# EAGLE design BEP32 (EAGLE 6.5.0)
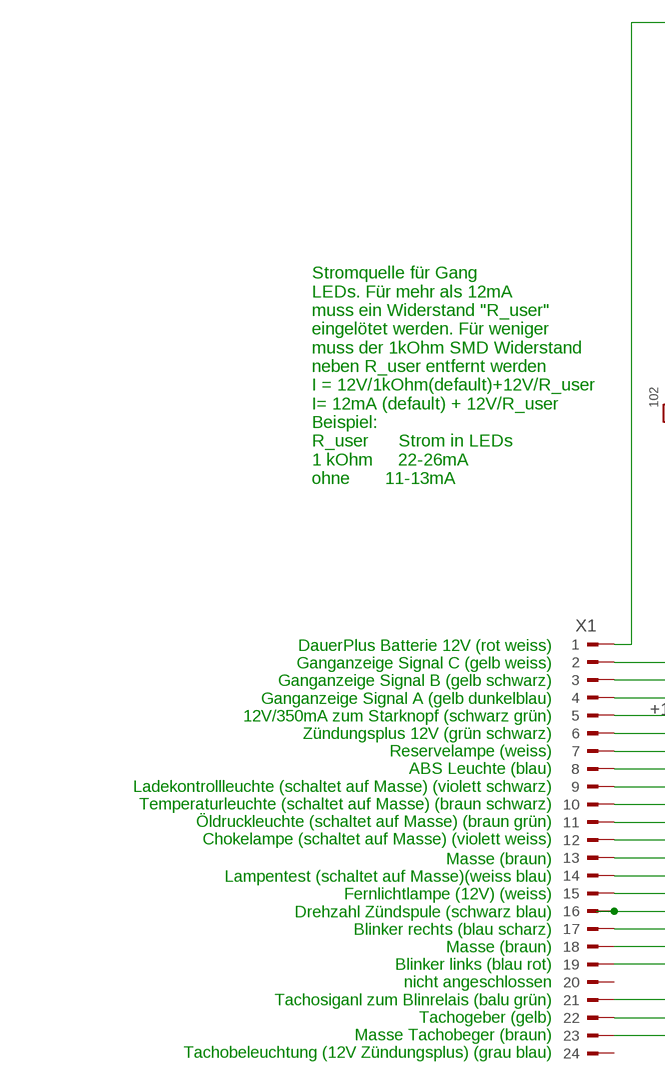
[diagram p0: schematic, sheet 1, part 1 of 2]
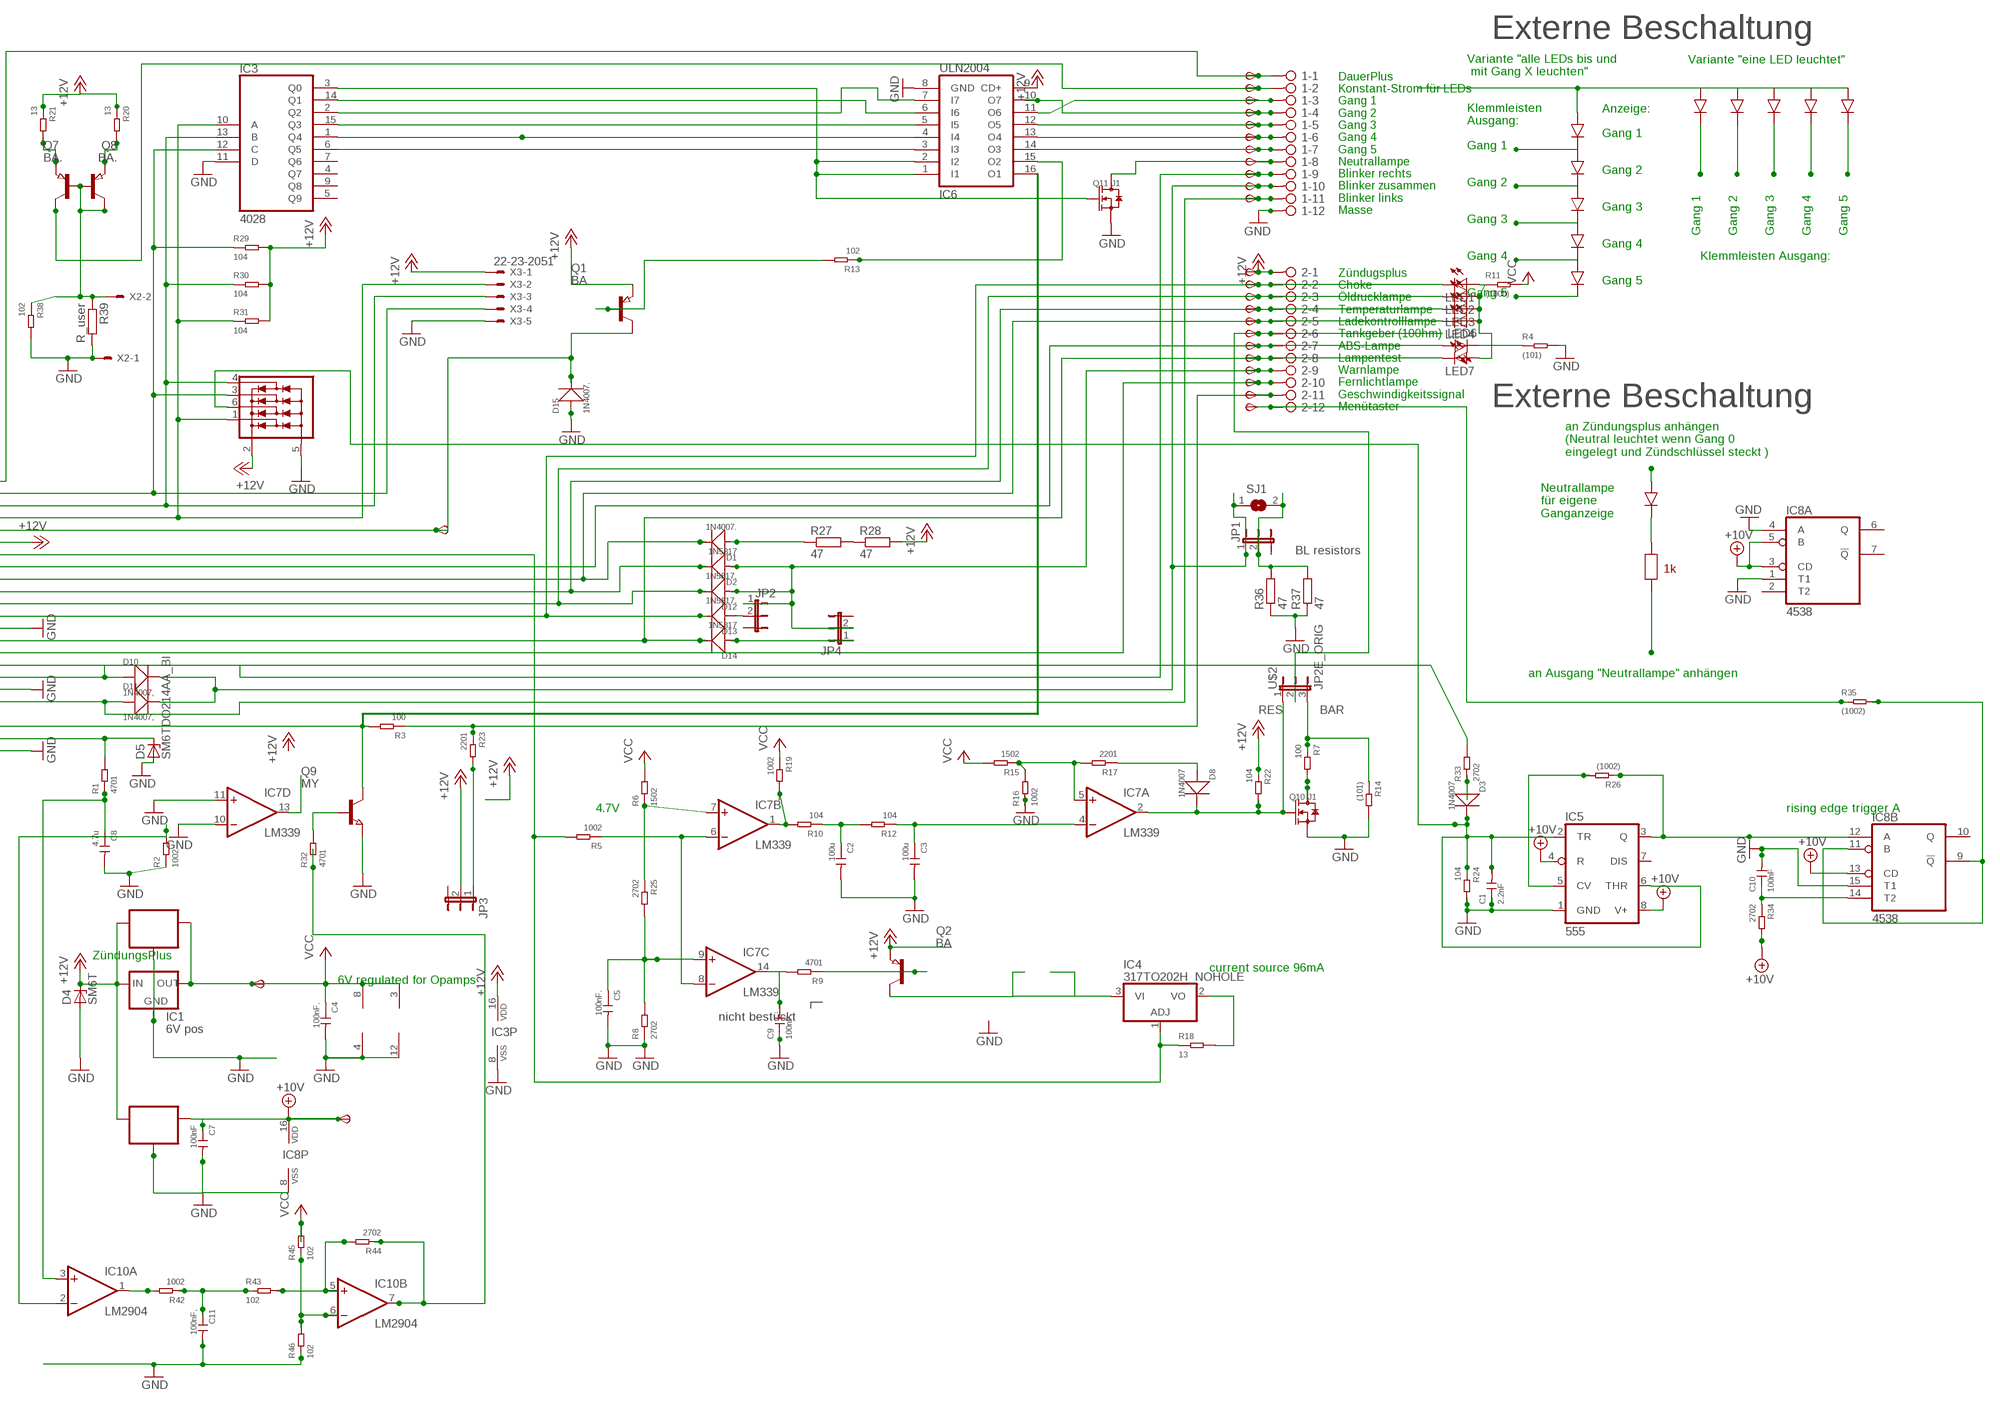
[diagram p1: schematic, sheet 1, part 2 of 2]

## Parts
1  2081-1132  [12-PIN]
2  2081-1132  [12-PIN]
6V  TPSB2.0  [B2.0]
10V  TPSB2.0  [B2.0]
C1  2.2nF  CERAMIC-100NF-50V-10%-X7R(0805)  [C0805]
C2  100u  CERAMIC-100UF-6.3V-20%-X5R(1206)  [C1206]
C3  100u  CERAMIC-100UF-6.3V-20%-X5R(1206)  [C1206]
C4  100nF,  CERAMIC-100NF-50V-10%-X7R(0805)  [C0805]
C5  100nF.  CERAMIC-100NF-50V-10%-X7R(0805)  [C0805]
C7  100nF  CERAMIC-100NF-50V-10%-X7R(0805)  [C0805]
C8  4.7u  CERAMIC-4.7UF-25V-10%-X5R(0805)  [C0805]
C9  100nF.  CERAMIC-100NF-50V-10%-X7R(0805)  [C0805]
C10  100nF  CERAMIC-100NF-50V-10%-X7R(0805)  [C0805]
C11  100nF,  CERAMIC-100NF-50V-10%-X7R(0805)  [C0805]
D1  1N4007.  DIODE-GEN-PURPOSE-1KV-1A(DO-214AC)  [DO-214AC]
D2  1N5817  DIODE-GEN-PURPOSE-1KV-1A(DO-214AC)DO-214AC/1206  [DO-214AC_SLIM]
D3  1N4007  DIODE-GEN-PURPOSE-1KV-1A(DO-214AC)  [DO-214AC]
D4  SM6T  [DO214AA]
D5  SM6TDO214AA_BI  [DO214AA_BI]
D8  1N4007  DIODE-GEN-PURPOSE-1KV-1A(DO-214AC)  [DO-214AC]
D10  1N4007,  DIODE-GEN-PURPOSE-1KV-1A(DO-214AC)  [DO-214AC]
D11  1N4007,  DIODE-GEN-PURPOSE-1KV-1A(DO-214AC)  [DO-214AC]
D12  1N5817.  DIODE-GEN-PURPOSE-1KV-1A(DO-214AC)DO-214AC/1206  [DO-214AC_SLIM]
D13  1N5817.  DIODE-GEN-PURPOSE-1KV-1A(DO-214AC)DO-214AC/1206  [DO-214AC_SLIM]
D14  1N5817  DIODE-GEN-PURPOSE-1KV-1A(DO-214AC)DO-214AC/1206  [DO-214AC_SLIM]
D15  1N4007.  DIODE-GEN-PURPOSE-1KV-1A(DO-214AC)  [DO-214AC]
IC1  6V pos  78LXX  [78LXX]
IC2  78L06  78LXXSOT89_ROUND  [SOT89_ROUND]
IC3  4028  4028D  [SO16]
IC4  317TO202H_NOHOLE  [TO220H_NOHOLE]
IC5  555  NE555D  [SO08]
IC6  ULN2004  ULN2004AD  [SO16]
IC7  LM339  LM339D  [SO14]
IC8  4538  4538D  [SO16]
IC9  78L10  78LXXSOT89_ROUND  [SOT89_ROUND]
IC10  LM2904  LM358D  [SO08]
JP1  JP2EJP2_SMALLPADS  [JP2_SMALLPADS]
JP2  JP2EJP2_SMALLPADS  [JP2_SMALLPADS]
JP3  JP2EJP2_SMALLPADS  [JP2_SMALLPADS]
JP4  JP2EJP2_SMALLPADS  [JP2_SMALLPADS]
LED1  LEDLD260  [LD260]
LED2  LEDLD260  [LD260]
LED3  LEDLD260  [LD260]
LED4  LEDLD260  [LD260]
LED6  LEDLD260  [LD260]
LED7  LEDLD260  [LD260]
Q1  BA  PNP-TRANSISTOR_SOT89  [SOT89]
Q2  BA  PNP-TRANSISTOR_SOT89  [SOT89]
Q7  BA.  PNP-TRANSISTOR_SOT89  [SOT89]
Q8  BA.  PNP-TRANSISTOR_SOT89  [SOT89]
Q9  MY  NPN-TRANSISTOR_SOT89  [SOT89]
Q10  J1  SMD-MOSFET-N-CH-50V-200MA-BSS138W-7-F(SOT-23)  [SOT-23]
Q11  J1  SMD-MOSFET-N-CH-50V-200MA-BSS138W-7-F(SOT-23)  [SOT-23]
R1  4701  SMD-RES-4.7K-5%-1/8W(0805)  [R0805]
R2  1002  SMD-RES-10K-1%-1/8W(0805)  [R0805]
R3  100  SMD-RES-220R-5%-1/8W(0805)  [R0805]
R4  (101)  SMD-RES-100R-5%-1/8W(0805)  [R0805]
R5  1002  SMD-RES-10K-1%-1/8W(0805)  [R0805]
R6  1502  SMD-RES-10K-1%-1/8W(0805)  [R0805]
R7  100  SMD-RES-2.2K-5%-1/8W(0805)  [R0805]
R8  2702  SMD-RES-4.7K-5%-1/8W(0805)  [R0805]
R9  4701  SMD-RES-4.7K-5%-1/8W(0805)  [R0805]
R10  104  SMD-RES-10K-1%-1/8W(0805)  [R0805]
R11  (1000)  SMD-RES-100R-5%-1/8W(0805)  [R0805]
R12  104  SMD-RES-10K-1%-1/8W(0805)  [R0805]
R13  102  SMD-RES-1K-5%-1/8W(0805)  [R0805]
R14  (101)  SMD-RES-2.2K-5%-1/8W(0805)  [R0805]
R15  1502  SMD-RES-10K-1%-1/8W(0805)  [R0805]
R16  1002  SMD-RES-10K-1%-1/8W(0805)  [R0805]
R17  2201  SMD-RES-2.2K-5%-1/8W(0805)  [R0805]
R18  13  SMD-RES-13R-5%-1/4W(1206)  [R1206]
R19  1002  SMD-RES-10K-1%-1/8W(0805)  [R0805]
R20  13  SMD-RES-13R-5%-1/4W(1206)  [R1206]
R21  13  SMD-RES-13R-5%-1/4W(1206)  [R1206]
R22  104  SMD-RES-10K-1%-1/8W(0805)  [R0805]
R23  2201  SMD-RES-2.2K-5%-1/8W(0805)  [R0805]
R24  104  SMD-RES-10K-1%-1/8W(0805)  [R0805]
R25  2702  SMD-RES-4.7K-5%-1/8W(0805)  [R0805]
R26  (1002)  SMD-RES-10K-1%-1/8W(0805)  [R0805]
R27  47  R-EU_V235/17_1MM  [V235/17_1MM]
R28  47  R-EU_V235/17_1MM  [V235/17_1MM]
R29  104  SMD-RES-10K-1%-1/8W(0805)  [R0805]
R30  104  SMD-RES-10K-1%-1/8W(0805)  [R0805]
R31  104  SMD-RES-10K-1%-1/8W(0805)  [R0805]
R32  4701  SMD-RES-4.7K-5%-1/8W(0805)  [R0805]
R33  2702  SMD-RES-10K-1%-1/8W(0805)  [R0805]
R34  2702  SMD-RES-4.7K-5%-1/8W(0805)  [R0805]
R35  (1002)  SMD-RES-4.7K-5%-1/8W(0805)  [R0805]
R36  47  R-EU_V235/17_1MM  [V235/17_1MM]
R37  47  R-EU_V235/17_1MM  [V235/17_1MM]
R38  102  SMD-RES-1K-5%-1/8W(0805)  [R0805]
R39  R_user  R-EU_R0805  [R0805]
R42  1002  SMD-RES-10K-1%-1/8W(0805)  [R0805]
R43  102  SMD-RES-1K-5%-1/8W(0805)  [R0805]
R44  2702  SMD-RES-4.7K-5%-1/8W(0805)  [R0805]
R45  102  SMD-RES-1K-5%-1/8W(0805)  [R0805]
R46  102  SMD-RES-1K-5%-1/8W(0805)  [R0805]
SJ1  SJ  [SJ]
START  TPSB2.0  [B2.0]
TP1  TPSB2.0  [B2.0]
TP2  TPSB2.0  [B2.0]
TP3  TPSB2.0  [B2.0]
TP4  TPSB2.0  [B2.0]
TP5  TPSB2.0  [B2.0]
TP6  TPSB2.0  [B2.0]
TP7  TPSB2.0  [B2.0]
TP8  TPSB2.0  [B2.0]
TP9  TPSB2.0  [B2.0]
TP10  TPSB2.0  [B2.0]
TP11  TPSB2.0  [B2.0]
TP12  TPSB2.0  [B2.0]
TP13  TPSB2.0  [B2.0]
TP16  TPSB2.0  [B2.0]
TP17  TPSB2.0  [B2.0]
TP18  TPSB2.0  [B2.0]
TP19  TPSB2.0  [B2.0]
TP21  TPSB2.0  [B2.0]
TP22  TPSB2.0  [B2.0]
TP23  TPSB2.0  [B2.0]
TP24  TPSB1,27  [B1,27]
TP25  TPSB2.0  [B2.0]
TP26  TPSB2.0  [B2.0]
U$2  JP2E_ORIG  [JP2_ORIG_SMALLPADS]
U$3  NUP4304SOT457_R  [SOT457R_PHILIPS]
X1  CON_BMWV2  [24-PIN_V2]
X2  22-23-2021  [22-23-2021]
X3  22-23-2051  [22-23-2051]

## Nets
+10V: 10V.TP(PP) C7.1 IC5.4(R) IC5.8(V+) IC8.3(A:CD) IC8.5(A:B) IC8.13(B:CD) IC8.16(P:VDD) IC9.1(OUT) R34.2
+12V: 2.1 D4.C IC1.IN IC2.3(IN) IC3.16(VDD) IC6.9(CD+) IC9.3(IN) JP3.2 Q1.3(E) Q2.3(E) R20.1 R21.1 R22.1 R28.2 R29.2 R30.2 R31.2 TP12.TP(PP) U$3.2(V+) X1.6 X3.1
+12V1: IC10.7(B:OUT) R32.1 R44.1
GND: 1.12 C1.1 C2.2 C3.2 C4.2 C5.2 C7.2 C8.2 C9.1 C10.2 C11.2 D4.A D5.A D15.1(+) IC1.GND IC2.2(GND) IC2.2@1(GND) IC3.8(VSS) IC3.11(D) IC5.1(GND) IC6.8(GND) IC7.10(D:-IN) IC7.11(D:+IN) IC7.12(P:GND) IC8.1(A:T1) IC8.4(A:A) IC8.8(P:VSS) IC8.15(B:T1) IC9.2(GND) IC9.2@1(GND) IC10.4(P:V-) Q9.3(E) Q10.2(S) Q11.2(S) R2.1 R4.2 R8.1 R14.2 R16.1 R24.2 R36.1 R37.1 R38.2 R39.2 R46.1 U$3.5(V-) X1.13 X1.18 X1.23 X2.1 X3.5
N$1: 2.9 D2.1(+) D12.1(+) JP2.1 JP4.2 TP24.TP(PP)
N$2: IC3.10(A) R31.1 U$3.1(D1) X1.4 X3.2
N$3: IC3.13(B) R30.1 U$3.4(D4) X1.3 X3.3
N$4: 2.7 LED6.A TP22.TP(PP) X1.8
N$5: Q8.3(E) R21.2
N$6: D8.2(-) IC7.2(A:OUT) Q10.1(G) R22.2 U$2.1
N$7: IC10.2(A:-IN) R2.2
N$8: R27.2 R28.1
N$9: Q7.3(E) R20.2
N$11: D15.2(-) Q1.2(C) START.TP(PP) X1.5
N$12: 2.2 D13.2(-) LED1.K(C) TP16.TP(PP) X1.12
N$13: 2.3 D12.2(-) LED2.K(C) TP17.TP(PP) X1.11
N$14: 2.4 D2.2(-) LED3.K(C) TP18.TP(PP) X1.10
N$15: IC4.3(VI) Q2.2(C)
N$16: IC7.6(B:-IN) IC7.8(C:-IN) R5.1
N$17: IC3.12(C) R29.1 U$3.3(D3) X1.2 X3.4
N$18: IC3.15(Q3) IC6.5(I5)
N$19: 2.8 D14.2(-) LED7.K(C) TP23.TP(PP) X1.14
N$20: 1.9 D10.1(+) TP9.TP(PP) X1.17
N$21: 1.11 D11.1(+) TP11.TP(PP) X1.19
N$22: IC8.9(B:!Q) IC8.11(B:B) R35.2
N$23: D5.C R1.2 X1.22
N$24: C8.1 IC10.3(A:+IN) R1.1
N$25: 1.6 IC6.13(O4) TP6.TP(PP)
N$26: 1.7 IC6.14(O3) TP7.TP(PP)
N$27: 2.11 R3.1 R23.1 TP26.TP(PP)
N$28: 2.6 TP21.TP(PP) U$2.2
N$29: JP3.1 R23.2
N$30: C5.1 IC7.9(C:+IN) R8.2 R25.2
N$31: C9.2 IC7.14(C:OUT) R9.2
N$32: C1.2 D3.2(-) IC5.2(TR) IC5.6(THR) R24.1 U$3.6(D2)
N$34: LED6.K(C) R4.1
N$35: IC4.1(ADJ) R5.2 R18.1 X1.7
N$36: Q2.1(B) R9.1
N$37: IC3.2(Q2) IC6.7(I7)
N$38: 1.3 IC6.11(O6) TP3.TP(PP)
N$39: 1.5 IC6.12(O5) TP5.TP(PP)
N$41: LED1.A LED2.A LED3.A LED4.A LED7.A R11.1
N$42: R33.2 X1.16
N$43: Q1.1(B) R13.2
N$44: IC3.3(Q0) IC6.1(I1) IC6.2(I2) Q11.1(G)
N$45: C2.1 R10.1 R12.2
N$46: C3.1 IC7.4(A:-IN) R12.1
N$47: IC7.5(A:+IN) R15.1 R16.2 R17.2
N$48: Q10.3(D) R7.2
N$49: D8.1(+) R17.1
N$50: IC3.1(Q4) IC6.4(I4)
N$52: 1.8 Q11.3(D) TP8.TP(PP)
N$53: 2.10 TP25.TP(PP) X1.15
N$54: D1.1(+) R27.1
N$55: 2.5 D1.2(-) LED4.K(C) TP19.TP(PP) X1.9
N$56: IC3.14(Q1) IC6.6(I6)
N$57: Q7.1(B) Q7.2(C) Q8.1(B) R38.1 R39.1 X2.2
N$59: 1.2 Q8.2(C) TP2.TP(PP)
N$60: IC7.13(D:OUT)
N$61: IC3.6(Q5) IC6.3(I3)
N$64: IC4.2(VO) R18.2
N$65: IC5.5(CV) R26.2
N$67: 1.4 IC6.10(O7) TP4.TP(PP)
N$69: 1.1 TP1.TP(PP) X1.1
N$83: IC7.7(B:+IN) R6.1 R25.1
N$84: IC6.16(O1) Q9.2(C) R3.2 X1.21
N$85: Q9.1(B) R32.2
N$86: IC5.3(Q) IC8.12(B:A) R26.1
N$87: D3.1(+) R33.1
N$88: IC6.15(O2) R13.1
N$89: C10.1 IC8.14(B:T2) R34.1
N$90: 2.12 R35.1 TP13.TP(PP)
N$92: IC10.1(A:OUT) R42.2
N$93: 1.10 D10.2(-) D11.2(-) JP1.1 SJ1.1 TP10.TP(PP)
N$94: JP1.2 R36.2 R37.2 SJ1.2
N$95: D13.1(+) JP2.2
N$96: C11.1 R42.1 R43.1
N$97: IC10.5(B:+IN) R43.2 R44.2
N$98: D14.1(+) JP4.1
N$99: R7.1 R14.1 U$2.3
N$101: IC10.6(B:-IN) R45.1 R46.2
N$580: IC7.1(B:OUT) R10.2 R19.2
VCC: 6V.TP(PP) C4.1 IC1.OUT IC2.1(OUT) IC7.3(P:V+) IC10.8(P:V+) R6.2 R11.2 R15.2 R19.1 R45.2
Unconnected: IC3.4(Q7) IC3.5(Q9) IC3.7(Q6) IC3.9(Q8) IC5.7(DIS) IC8.2(A:T2) IC8.6(A:Q) IC8.7(A:!Q) IC8.10(B:Q) X1.20 X1.24

## Notes on the sheet
- Externe Beschaltung
- Variante "eine LED leuchtet"
- Variante "alle LEDs bis und
   mit Gang X leuchten"
- Anzeige:
- Klemmleisten
  Ausgang:
- Gang 1
- DauerPlus
  Konstant-Strom für LEDs
  Gang 1
  Gang 2
  Gang 3
  Gang 4
  Gang 5
  Neutrallampe
  Blinker rechts
  Blinker zusammen
  Blinker links
  Masse
- Gang 1
- Gang 2
- Gang 2
- Gang 3
- Gang 3
- Gang 1 | Gang 2 | Gang 3 | Gang 4 | Gang 5
- Gang 4
- Gang 4 | Klemmleisten Ausgang:
- Gang 5
- Gang 5
- Zündugsplus
  Choke
  Öldrucklampe
  Temperaturlampe
  Ladekontrolllampe
  Tankgeber (100hm)
  ABS-Lampe
  Lampentest
  Warnlampe
  Fernlichtlampe
  Geschwindigkeitssignal
  Menütaster
- Stromquelle für Gang
  LEDs. Für mehr als 12mA
  muss ein Widerstand "R_user"
  eingelötet werden. Für weniger
  muss der 1kOhm SMD Widerstand
  neben R_user entfernt werden
  I = 12V/1kOhm(default)+12V/R_user
  I= 12mA (default) + 12V/R_user
  Beispiel:
  R_user      Strom in LEDs
  1 kOhm     22-26mA
  ohne       11-13mA
- Externe Beschaltung
- an Zündungsplus anhängen
  (Neutral leuchtet wenn Gang 0
  eingelegt und Zündschlüssel steckt )
- Neutrallampe
  für eigene
  Ganganzeige
- DauerPlus Batterie 12V (rot weiss)
  Ganganzeige Signal C (gelb weiss)
  Ganganzeige Signal B (gelb schwarz)
  Ganganzeige Signal A (gelb dunkelblau)
  12V/350mA zum Starknopf (schwarz grün)
  Zündungsplus 12V (grün schwarz)
  Reservelampe (weiss)
  ABS Leuchte (blau)
  Ladekontrollleuchte (schaltet auf Masse) (violett schwarz)
  Temperaturleuchte (schaltet auf Masse) (braun schwarz)
  Öldruckleuchte (schaltet auf Masse) (braun grün)
  Chokelampe (schaltet auf Masse) (violett weiss)
- BL resistors
- 1k
- an Ausgang "Neutrallampe" anhängen
- Masse (braun)
  Lampentest (schaltet auf Masse)(weiss blau)
  Fernlichtlampe (12V) (weiss)
  Drehzahl Zündspule (schwarz blau)
  Blinker rechts (blau scharz)
  Masse (braun)
  Blinker links (blau rot)
  nicht angeschlossen
  Tachosiganl zum Blinrelais (balu grün)
  Tachogeber (gelb)
  Masse Tachobeger (braun)
  Tachobeleuchtung (12V Zündungsplus) (grau blau)
- RES | BAR
- 4.7V | rising edge trigger A
- ZündungsPlus
- current source 96mA
- 6V regulated for Opamps
- nicht bestückt

## Library data of the parts
1 2 = con WAGO BMW:2081-1132: WAGO SREW CLAMP
6V 10V START TP1-TP13 TP16-TP19 TP21-TP26 = testpin_BMW:TPS: TEST PIN
C1 C4 C5 C7 C9-C11 = Seeed-Capacitor-2016:CERAMIC-100NF-50V-10%-X7R(0805): 302010165; MPN: CC0805KRX7R9BB104; VALUE: 100nf
C2 C3 = Seeed-Capacitor-2016:CERAMIC-100UF-6.3V-20%-X5R(1206): 302010183; MPN: GRM31CR60J107ME39L; VALUE: 100uf
C8 = Seeed-Capacitor-2016:CERAMIC-4.7UF-25V-10%-X5R(0805): 302010146; MPN: CC0805KKX5R8BB475; VALUE: 4.7uf
D1 D10 D11 D15 = Diode-do214ac:DIODE-GEN-PURPOSE-1KV-1A(DO-214AC): 304010013; MPN: 1N4007; VALUE: 1N4007
D2 D12-D14 = Diode-do214ac:DIODE-GEN-PURPOSE-1KV-1A(DO-214AC): 304010013
D3 D8 = Diode-do214ac:DIODE-GEN-PURPOSE-1KV-1A(DO-214AC): 304010013; MPN: 1N4007
D4 D5 = Suppressor_Diode_DO214AA:SM6T: Z DIODE
IC1 = v-reg:78LXX: VOLTAGE REGULATOR
IC2 IC9 = 78LXX:78LXX
IC3 = 4028:4028: BCD to decimal DECODER
IC4 = linear_BMW:*317: Positive VOLTAGE REGULATOR
IC5 = linear:*555: TIMER
IC6 = uln-udn:ULN2004A: DRIVER ARRAY
IC7 = LM339:LM339: Low Power Low Offset Voltage Quad Comparators with open collector; LM139/LM239/LM339/LM2901/LM3302
IC8 = 45xx:4538: Dual precision monostable MULTIVIBRATOR
IC10 = linear_BMW:LM358: OP AMP also LM158; LM258; LM2904 Source: http://cache.national.com/ds/LM/LM158.pdf
JP1-JP4 = Switch Aliexpress 2:JP2E: JUMPER
LED1-LED4 LED6 LED7 = led:LED: LED OSRAM: - CHIPLED LG R971, LG N971, LY N971, LG Q971, LY Q971, LO R971, LY R971 LH N974, LH R974 LS Q976, LO Q976, LY Q976 LO Q996 - Hyper CHIPLED LW Q18S LB Q993, LB Q99A, LB R99A - SideLED LS A670, LO A670, LY A670, LG A670, LP A670 LB A673, LV A673, LT A673, LW A673 LH A674 LY A675 LS A676, LA A676, LO A676, LY A676, LW A676 LS A679, LY A679, LG A679 - Hyper Micro SIDELED® LS Y876, LA Y876, LO Y876, LY Y876 LT Y87S - SmartLED LW L88C, LW L88S LB L89C, LB L89S, LG L890 LS L89K, LO L89K, LY L89K LS L896, LA L896, LO L896, LY L896 - TOPLED LS T670, LO T670, LY T670, LG T670, LP T670 LSG T670, LSP T670, LSY T670, LOP T670, LYG T670 LG T671, LOG T671, LSG T671 LB T673, LV T673, LT T673, LW T673 LH T674 LS T676, LA T676, LO T676, LY T676, LB T676, LH T676, LSB T676, LW T676 LB T67C, LV T67C, LT T67C, LS T67K, LO T67K, LY T67K, LW E67C LS E67B, LA E67B, LO E67B, LY E67B, LB E67C, LV E67C, LT E67C LW T67C LS T679, LY T679, LG T679 LS T770, LO T770, LY T770, LG T770, LP T770 LB T773, LV T773, LT T773, LW T773 LH T774 LS E675, LA E675, LY E675, LS T675 LS T776, LA T776, LO T776, LY T776, LB T776 LHGB T686 LT T68C, LB T68C - Hyper Mini TOPLED® LB M676 - Mini TOPLED Santana® LG M470 LS M47K, LO M47K, LY M47K Source: http://www.osram.convergy.de LUXEON: - LUMILED® LXK2-PW12-R00, LXK2-PW12-S00, LXK2-PW14-U00, LXK2-PW14-V00 LXK2-PM12-R00, LXK2-PM12-S00, LXK2-PM14-U00 LXK2-PE12-Q00, LXK2-PE12-R00, LXK2-PE12-S00, LXK2-PE14-T00, LXK2-PE14-U00 LXK2-PB12-K00, LXK2-PB12-L00, LXK2-PB12-M00, LXK2-PB14-N00, LXK2-PB14-P00, LXK2-PB14-Q00 LXK2-PR12-L00, LXK2-PR12-M00, LXK2-PR14-Q00, LXK2-PR14-R00 LXK2-PD12-Q00, LXK2-PD12-R00, LXK2-PD12-S00 LXK2-PH12-R00, LXK2-PH12-S00 LXK2-PL12-P00, LXK2-PL12-Q00, LXK2-PL12-R00 Source: www.luxeon.com KINGBRIGHT: KA-3528ASYC Source: www.kingbright.com
Q1 Q2 Q7 Q8 = Transistor_SOT89:PNP-TRANSISTOR_: PNP TRANSISTOR
Q9 = Transistor_SOT89:NPN-TRANSISTOR_: NPN TRANSISTOR
Q10 Q11 = Seeed-Transistor-2016:SMD-MOSFET-N-CH-50V-200MA-BSS138W-7-F(SOT-23): 305030000; MPN: BSS138W-7-F; VALUE: BSS138W-7-F
R1 R8 R9 R25 R32 R34 R35 R44 = Seeed-Resistor-2016:SMD-RES-4.7K-5%-1/8W(0805): 301010306; MPN: RC0805JR-074K7L; VALUE: 4.7K
R2 R5 R6 R10 R12 R15 R16 R19 R22 R24 R26 R29-R31 R33 R42 = Seeed-Resistor-2016:SMD-RES-10K-1%-1/8W(0805): 301010361; MPN: RC0805FR-0710KL; VALUE: 10K
R3 = Seeed-Resistor-2016:SMD-RES-220R-5%-1/8W(0805): 301010315; MPN: RC0805JR-07220RL; VALUE: 220R
R4 R11 = Seeed-Resistor-2016:SMD-RES-100R-5%-1/8W(0805): 301010319; MPN: RC0805JR-07100RL; VALUE: 100R
R7 R14 R17 R23 = Seeed-Resistor-2016:SMD-RES-2.2K-5%-1/8W(0805): 301010333; MPN: RC0805JR-072K2L; VALUE: 2.2K
R13 R38 R43 R45 R46 = Seeed-Resistor-2016:SMD-RES-1K-5%-1/8W(0805): 301010311; MPN: RC0805JR-071KL; VALUE: 1K
R18 R20 R21 = Seeed-Resistor-2016:SMD-RES-13R-5%-1/4W(1206): 301010405; MPN: RC1206JR-0713RL; VALUE: 13R
R27 R28 R36 R37 R39 = rcl:R-EU_: RESISTOR, European symbol
SJ1 = solder-jumper:SJ: SMD solder JUMPER
U$2 = Switch Aliexpress 2:JP2E_ORIG
U$3 = NUP4304_ESD_Diode_Array:NUP4304
X1 = con_BMW:CON_BMW: BMW CONNECTOR
X2 = con_Molex_BMW:22-23-2021: .100" (2.54mm) Center Header - 2 Pin; MF: MOLEX; MPN: 22-23-2021; OC_FARNELL: 1462926; OC_NEWARK: 25C3832
X3 = con_Molex_BMW:22-23-2051: .100" (2.54mm) Center Header - 5 Pin; MF: MOLEX; MPN: 22-23-2051; OC_FARNELL: 1462952; OC_NEWARK: 38C9178

## Board
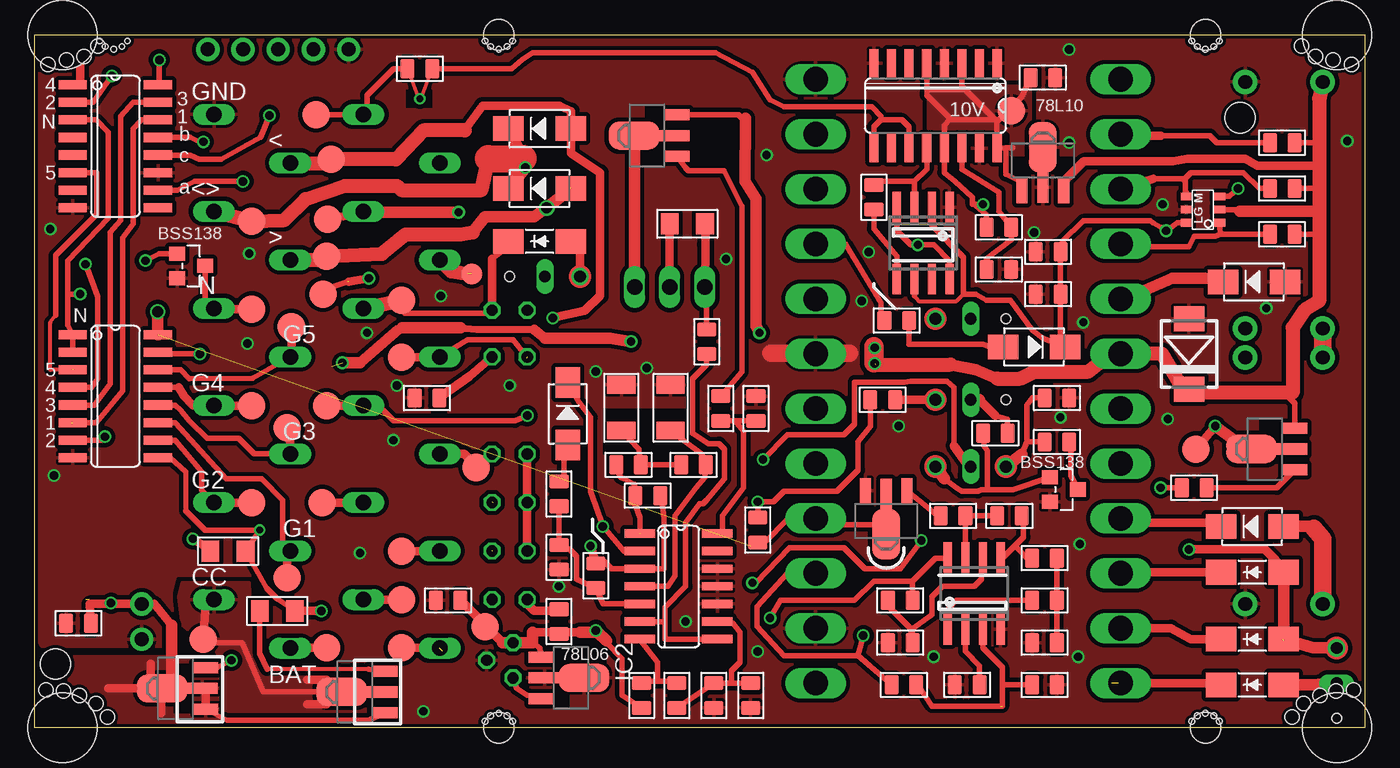
[diagram p2: board, top side]
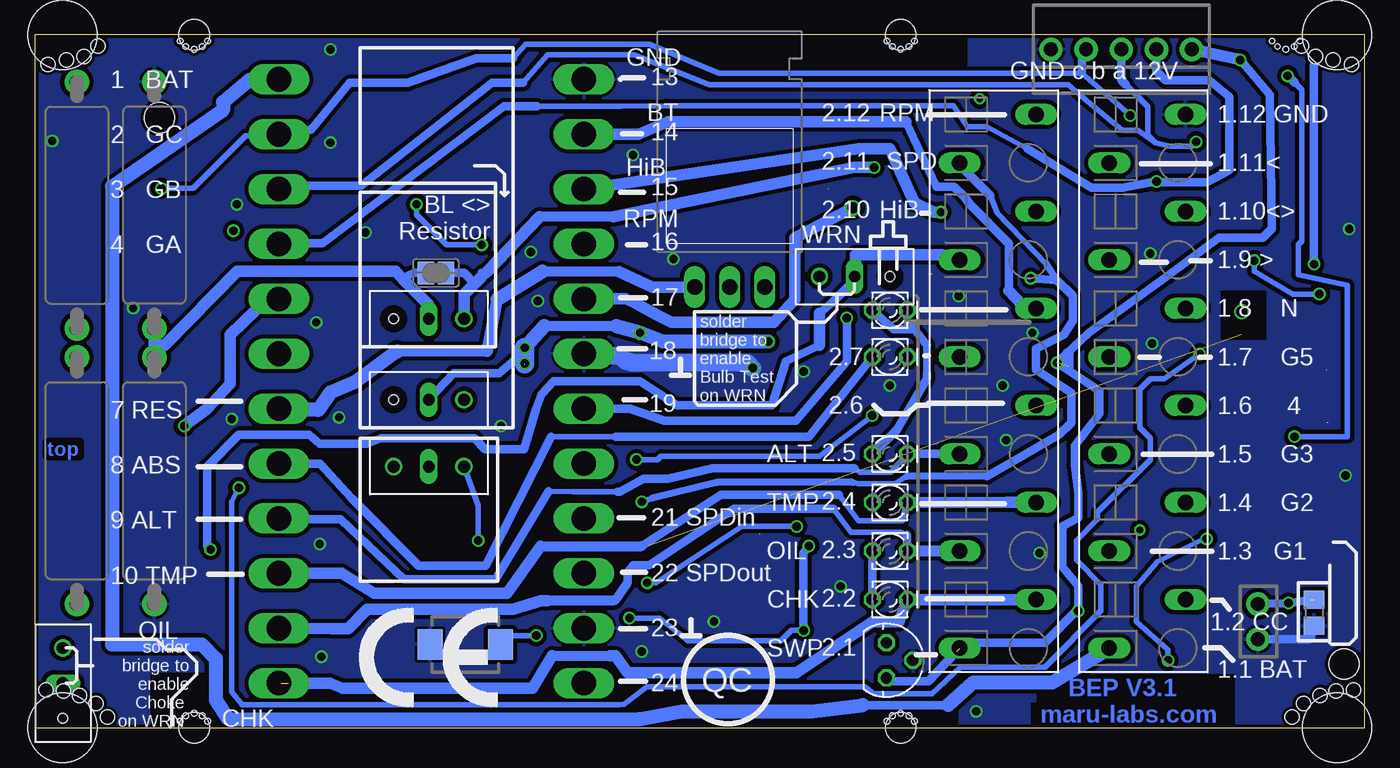
[diagram p3: board, bottom side, seen from below]

Size 96 x 50 mm. Coordinates in mm from the lower left corner, seen from the top.
Outline: 96,0 0,0 0,50 96,50 96,0
Copper layers (1*16): Top 0.035mm / dielectric 1.5mm / Bottom 0.035mm
Design rules "multi-cb_035um-cu *": minimum track width 6mil, minimum drill 12mil, track to track 12mil, track to pad 12mil, pad to pad 6mil, via to via 6mil, smd to smd 6mil, copper to edge 10mil, drill to drill 8mil, minimum pad ring 8mil, minimum via ring 6mil, stop-mask expansion 3mil, vias tented up to drill 0mil, thermal gap 8mil
Holes 1.02 mm at 0.81,2.71 2.08,2.64 3.23,2.33 4.43,1.75 5.24,0.77 95.05,47.86 93.71,48.17 92.44,48.43 91.43,49.19 95.19,2.71 93.92,2.64 92.77,2.33 91.57,1.75 90.76,0.77 0.95,47.86 2.29,48.17 3.56,48.43 4.57,49.19
Holes 2.18 mm at 1.5,4.6 87,44
Holes 0.4 mm at 33.5,1.06 34.1,0.86 34.5,0.46 32.9,0.86 32.5,0.46 84.5,1.06 85.1,0.86 85.5,0.46 83.9,0.86 83.5,0.46 84.5,48.94 83.9,49.14 83.5,49.54 85.1,49.14 85.5,49.54 33.5,48.94 32.9,49.14 32.5,49.54 34.1,49.14 34.5,49.54 5.7,48.94 5.1,49.14 4.7,49.54 6.3,49.14 6.7,49.54
Holes 2.2 mm at 84.5,0 33.5,0 33.5,50 84.5,50
Holes 5 mm at 94,0 94,50 2,0 2,50
tRestrict: area 41,19.7 to 47.5,23; area 26.8,44.7 to 28.7,46; area 58.4,15.3 to 60.2,17.3; area 44.1,40.6 to 45.5,44.9; area 37.3,1.4 to 38.6,5.9; area 38.6,4.6 to 41.3,5.8; area 10,1.1 to 11.4,4.6; area 70.3,39.9 to 75,41.2; area 88.4,21.1 to 90,22.3; area 81.1,36.7 to 82.2,36.9
bRestrict: area 9.4,0.3 to 19.6,3.8; area 19.5,0.3 to 24.1,1.8; area 29.3,0 to 35.8,2.2; area 28.7,47.4 to 35.2,49.8; area 81.6,0.2 to 87.6,4; area 7.1,28 to 10.4,31.5

### Footprints (pad centres in the part's own frame; a part is rotated, then mirrored left to right if it is on the bottom)
12-PIN = drill 1.118 long: 1 19.25,-2.45; 2 15.75,3.05; 3 12.25,-2.45; 4 8.75,3.05; 5 5.25,-2.45; 6 1.75,3.05; 7 -1.75,-2.45; 8 -5.25,3.05; 9 -8.75,-2.45; 10 -12.25,3.05; 11 -15.75,-2.45; 12 -19.25,3.05
B2.0 = smd 2 x 2: TP 0,0
C0805 = smd 1.397 x 1.016: 1 0,0.889; 2 0,-0.889
C1206 = smd 1.27 x 2.032: 1 -1.651,0; 2 1.651,0
DO-214AC = smd 2.2 x 1.77: 1 -2.242,0; 2 2.242,0
DO-214AC_SLIM = smd 2.2 x 1.77: 1 -2.242,0; 2 2.242,0
DO214AA = smd 1.8 x 2.2: A 2.55,0; C -2.55,0
DO214AA_BI = smd 1.8 x 2.2: A 2.45,0; C -2.65,0
ROUND_1.5MM_TPLACE = smd 1.5 x 1.5: P$1 0,0
78LXX = drill 0.813 octagon: GND 0,1.905; IN 1.27,0; OUT -1.27,0
SOT89_ROUND = smd 0.8 x 1.8: 1 -1.499,-2.181; 3 1.499,-2.181 | smd 0.8 x 2.3: 2 0,-1.927 | smd 2.032 x 3.65: 2@1 0,0.94
SO16 = smd 0.66 x 2.032: 1 -4.445,-3.073; 2 -3.175,-3.073; 3 -1.905,-3.073; 4 -0.635,-3.073; 5 0.635,-3.073; 6 1.905,-3.073; 7 3.175,-3.073; 8 4.445,-3.073; 9 4.445,3.073; 10 3.175,3.073; 11 1.905,3.073; 12 0.635,3.073; 13 -0.635,3.073; 14 -1.905,3.073; 15 -3.175,3.073; 16 -4.445,3.073
TO220H_NOHOLE = drill 1.118 long: 1 -2.54,-10.16; 2 0,-10.16; 3 2.54,-10.16
SO08 = smd 0.6 x 2.2: 1 -1.905,-2.6; 2 -0.635,-2.6; 3 0.635,-2.6; 4 1.905,-2.6; 5 1.905,2.6; 6 0.635,2.6; 7 -0.635,2.6; 8 -1.905,2.6
SO14 = smd 0.6 x 2.2: 1 -3.81,-2.8; 2 -2.54,-2.8; 3 -1.27,-2.8; 4 0,-2.8; 5 1.27,-2.8; 6 2.54,-2.8; 7 3.81,-2.8; 8 3.81,2.8; 9 2.54,2.8; 10 1.27,2.8; 11 0,2.8; 12 -1.27,2.8; 13 -2.54,2.8; 14 -3.81,2.8
JP2_SMALLPADS = drill 0.85: 1 -2.54,0 | drill 0.85 long: 2 0,0 | hole 0.7: 2.54,0
LD260 = drill 0.813 octagon: A -1.27,0; K 1.27,0
SOT89 = smd 0.8 x 1.8: 1 -1.499,-2.181; 3 1.499,-2.181 | smd 0.8 x 2.3: 2 0,-1.927 | smd 2.032 x 3.65: 2@1 0,0.94
SOT-23 = smd 1.016 x 1.143: 1 -0.889,-1.016; 2 0.889,-1.016; 3 0,1.016
R0805 = smd 1.397 x 1.016: 1 0,0.889; 2 0,-0.889
R1206 = smd 1.27 x 1.524: 1 -1.27,0; 2 1.27,0
V235/17_1MM = drill 1 pad 1.778: 1 -8.89,0; 2 8.89,0
R0805' = smd 1.3 x 1.5: 1 -0.95,0; 2 0.95,0
SJ = smd 1.2 x 1.6: 1 -0.725,0; 2 0.725,0
B1,27 = smd 1.5 x 1.5: TP 0,0
JP2_ORIG_SMALLPADS = drill 0.85: 1 -2.54,0; 3 2.54,0 | drill 0.85 long: 2 0,0
SOT457R_PHILIPS = smd 0.55 x 0.8: 1 -0.95,-1.2; 2 0,-1.2; 3 0.95,-1.2; 4 0.95,1.2; 5 0,1.2; 6 -0.95,1.2
24-PIN_V2 = drill 1.778 long: 1 -21.78,-11; 2 -17.82,-11; 3 -13.86,-11; 4 -9.9,-11; 5 -5.94,-11; 6 -1.98,-11; 7 1.98,-11; 8 5.94,-11; 9 9.9,-11; 10 13.86,-11; 11 17.82,-11; 12 21.78,-11; 13 -21.78,11; 14 -17.82,11; 15 -13.86,11; 16 -9.9,11; 17 -5.94,11; 18 -1.98,11; 19 1.98,11; 20 5.94,11; 21 9.9,11; 22 13.86,11; 23 17.82,11; 24 21.78,11
22-23-2021 = drill 1 pad 1.676: 1 -1.27,0; 2 1.27,0
22-23-2051 = drill 1 pad 1.676: 1 -5.08,0; 2 -2.54,0; 3 0,0; 4 2.54,0; 5 5.08,0

### Placement (x,y rotation side)
1  15.99,25 270 bottom
2  26.79,25 270 bottom
6V  32.5,7.28 0 top
10V  70.5,44.5 0 top
C1  73.14,31.28 90 top
C2  42.34,23.09 90 top
C3  45.9,23.09 90 top
C4  29.83,9.18 270 top
C5  49.01,2.33 0 top
C7  72.76,46.9 90 top
C8  72.89,3.09 90 top
C9  52.06,23.03 0 top
C10  69.58,33.06 90 top
C11  72.89,6.14 270 top
D1  87.87,14.52 180 top
D2  87.87,11.22 180 top
D3  72.12,27.47 0 top
D4  83.3,26.96 90 top
D5  65.01,6.01 180 bottom
D8  38.47,22.65 90 top
D10  36.44,38.9 180 top
D11  36.44,43.22 180 top
D12  87.87,6.39 180 top
D13  87.87,3.09 180 top
D14  36.44,35.09 180 top
D15  88,32.17 180 top
FID1  FID1  [ROUND_1.5MM_TPLACE]  23.74,44.26 0 top
FID2  FID2  [ROUND_1.5MM_TPLACE]  78.37,7.19 0 top
IC1  34.53,4.87 270 bottom
IC2  38.72,3.6 270 top
IC3  5.83,41.95 270 top
IC4  45.84,41.95 0 bottom
IC5  64.12,34.97 180 top
IC6  5.83,23.92 270 top
IC7  46.47,10.2 270 top
IC8  65.01,44.87 180 top
IC9  72.76,40.93 0 top
IC10  67.81,9.69 0 top
JP1  67.55,29.5 180 bottom
JP2  93.97,3.21 270 bottom
JP3  67.55,23.66 180 bottom
JP4  36.82,32.55 0 bottom
LED1  34.28,9.25 0 bottom
LED2  34.28,12.75 0 bottom
LED3  34.28,16.25 0 bottom
LED4  34.28,19.75 0 bottom
LED6  34.28,26.75 0 bottom
LED7  34.28,30.12 0 bottom
Q1  88.76,20.11 90 top
Q2  44.18,42.71 90 top
Q7  10.15,2.83 90 top
Q8  23.1,2.58 90 top
Q9  61.46,14.9 180 top
Q10  74.28,17.18 270 top
Q11  11.29,33.31 270 top
R1  62.73,3.09 270 top
R2  67.3,3.09 90 top
R3  52.19,14.26 0 top
R4  28.31,23.79 270 top
R5  48.5,27.85 180 top
R6  43.8,2.33 0 top
R7  73.78,20.61 90 top
R8  51.68,2.33 180 top
R9  49.52,23.03 0 top
R10  42.85,18.96 270 top
R11  37.83,7.66 0 top
R12  47.55,18.96 270 top
R13  83.68,17.31 90 top
R14  73.78,23.79 90 top
R15  40.5,10.96 180 top
R16  37.83,12.3 180 top
R17  37.83,16.87 0 top
R18  47.1,36.36 180 top
R19  44.25,16.74 270 top
R20  13.96,12.74 180 top
R21  17.51,8.42 180 top
R22  69.33,21.25 270 top
R23  61.2,23.66 90 top
R24  73.14,34.33 270 top
R25  46.34,2.33 0 top
R26  60.57,38.27 0 top
R27  92.95,17.82 90 bottom
R28  92.95,37.7 90 bottom
R29  90.03,42.2 90 top
R30  90.03,38.9 90 top
R31  90.03,35.6 90 top
R32  66.28,15.28 270 top
R33  62.22,29.38 270 top
R34  69.58,36.11 270 top
R35  27.8,47.54 90 top
R36  87.36,17.82 90 bottom
R37  87.36,37.7 270 bottom
R38  3.16,7.53 270 top
R39  R_user  [R0805']  3.67,8.29 270 bottom
R42  72.89,9.18 270 top
R43  72.89,12.23 270 top
R44  70.35,15.28 90 top
R45  62.47,9.18 90 top
R46  62.47,6.14 90 top
SJ1  67.04,32.81 180 bottom
START  83.81,20.11 0 top
TP1  21.07,5.76 0 top
TP2  12.18,6.39 0 top
TP3  18.21,10.84 0 top
TP4  15.67,16.23 0 top
TP5  18.21,21.63 0 top
TP6  15.67,23.22 0 top
TP7  18.53,28.93 0 top
TP8  15.67,30.2 0 top
TP9  21.07,34.01 0 top
TP10  15.67,36.55 0 top
TP11  21.39,41 0 top
TP12  26.47,5.76 0 top
TP13  20.31,44.24 0 top
TP16  26.47,9.25 0 top
TP17  26.47,12.74 0 top
TP18  20.75,16.23 0 top
TP19  31.86,18.77 0 top
TP21  21.07,23.22 0 top
TP22  26.47,26.71 0 top
TP23  26.47,30.84 0 top
TP24  31.55,32.74 0 top
TP25  21.13,36.68 0 top
TP26  20.82,31.28 0 top
U$1  [CE_10.00]  72.63,1.44 0 bottom
U$2  67.55,18.84 180 bottom
U$3  84.32,37.38 90 top
X1  67.36,25 270 bottom
X2  7.74,7.66 90 bottom
X3  17.58,48.94 180 bottom

### Tracks (layer width: path | path; a pad name or v marks a point on that pad's centre or on a via)
+10V  (via drill 0.6)
  Top 0.406: 69.33,43.85 66.92,46.27 IC8.3 | 69.46,43.73 IC8.16 70.6,41.82 70.09,41.82 70.09,39.92 71.11,39.41 71.26,39.01 IC9.1 | 67.68,37.89 68.69,37 R34.2 | 66.16,43.85 66.03,43.85 65.65,43.47 IC8.13 65.65,40.05 66.41,39.41 67.68,38.27 67.68,37.89 | 66.16,43.85 69.33,43.85 | 69.33,43.85 69.46,43.73 | IC5.4 62.22,35.85 63.23,34.84 v63.74,34.84 64.89,34.84 66.03,33.7 IC5.8 | C7.1 71.23,45.51 69.46,43.73 | v68.44,37.76 67.68,37.76 67.68,37.89 | IC8.5 64.38,46.01 | 64.38,46.01 64.38,45.63 66.16,43.85 | 64.38,46.01 67.04,46.01
  Bottom 0.406: v68.44,37.76 68.44,37 66.28,34.84 v63.74,34.84
  pour Top: 64.38,46.27 71.87,46.27 71.87,40.3 70.47,40.3 70.47,42.84 70.09,43.22 64.5,43.22 64.5,46.14
+12V  (via drill 0.5, 0.6)  (3 unrouted)
  Top 0.35: 10.91,18.45 10.91,15.66
  Top 0.406: IC3.16 9.01,46.4 v9.01,48.17 | R21.1 17.51,9.31 16.75,10.07 R20.1 v16.24,14.26 12.31,14.26 10.91,15.66 | IC2.3 35.52,2.35 34.79,2.83 IC1.IN | R31.2 92.7,35.6 | R30.2 92.7,38.9 | 74.28,39.41 IC9.3 | R22.1 70.22,22.27 69.33,22.52 | U$3.2 86.86,37.38 86.98,37.25 | R29.2 92.7,42.2 | IC6.9 9.77,19.47 10.91,18.45 | D4.C 83.05,24.17 | 51.3,43.98 51.05,43.98 50.8,44.24 46.39,44.24 Q2.3 | Q1.3 90.94,23.4 90.17,24.17
  Top 0.5: 30.72,28.87 31.86,28.74 36.06,28.74
  Top 0.61: 2.1 TP12.TP 26.09,6.14 | 26.28,28.74 26.53,28.87 | R21.1 v20.69,8.42 | 92.7,40.55 88.25,40.55 87.36,41.06 83.17,41.06 82.16,40.86 75.73,40.86 74.28,39.41 | 69.33,22.52 68.19,23.66
  Top 0.711: 26.28,28.74 23.48,26.33 | 36.06,28.74 36.82,28.11
  Top 0.813: 23.48,26.33 v22.21,26.33 | 26.53,28.87 30.72,28.87 | 36.82,28.11 41.52,28.11 v43.04,27.85 | 66.09,26.2 67.93,25.82 69.46,25.19 | 51.3,43.98 51.27,39.44 52.06,38.16 52.06,29 v52.31,28.49 | 68.19,23.66 JP3.2 | 86.98,37.25 92.7,37.25
  Top 1.016: R28.2 92.7,45.38 92.7,42.2 92.7,40.55 92.7,38.9 92.7,37.25 92.7,35.6 92.7,30.77 91.68,30.14 90.79,28.87 90.79,24.17 90.17,24.17 83.05,24.17 81.37,26.96 X1.6 77.94,27.22 76.06,25.69 72.12,25.69 71.11,25.19 69.46,25.19 | 60.69,26.2 66.09,26.2
  Bottom 0.406: IC1.IN 34.28,3.34 | 29.45,5.5 29.48,5.5
  Bottom 0.61: v9.01,48.17 6.85,45.66 6.72,35.98 7.35,35.35 10.53,35.35 14.34,32.55 19.93,28.49 v22.21,26.33 19.16,24.3 19.16,22.65 20.94,20.36 20.94,18.96 20.69,16.93 20.69,15.15 21.83,14.52 21.83,11.6 20.69,10.2 v20.69,8.42 20.82,8.42 23.1,6.14 28.85,6.14 2.1 | 34.28,3.34 31.48,3.34 29.45,5.5 | JP3.2 65.77,25.57 62.47,25.57 60.82,26.96 v60.63,26.27
  Bottom 0.711: 54.03,28.97 59.23,28.97
  Bottom 0.813: v9.01,48.17 X3.1 | 21.45,26.96 21.45,26.07
  Bottom 1.016: v43.04,27.85 50.66,27.85 v52.31,28.49 54.03,28.97 | 59.23,28.97 v60.63,27.41
  Bottom 1.422: v60.63,27.41 v60.63,26.27
+12V1
  Top 0.406: IC10.7 R32.1 R44.1
GND  (via drill 0.6)
  Top 0.406: IC2.2@1 IC2.2
  Top 1.27: 58.79,27.03 53.14,27.03
  Bottom 0.61: X2.1 3.92,6.39 R39.2
  Bottom 1.27: v44.18,25.95 44.56,26.33 52.95,26.33 53.07,26.46 53.33,26.46 53.84,26.84 54.98,26.84
  other vias: 59.68,30.77 23.48,12.61 15.48,34.2 94.73,42.33 37.83,10.2 40.5,25.69 1.39,18.2 1.13,35.98 75.3,5.12 34.28,24.68 46.98,7.66 28.05,1.18 15.36,27.73 62.34,21.76 74.66,48.94 26.15,24.68 29.32,31.16 52.82,41.31 81.39,37.76 75.43,13.25 23.99,28.49 49.9,33.82 75.68,29.25 72.12,35.73 74.66,42.2 88.89,30.27 81.78,22.27 52.19,5.5 74.03,22.39 64.89,5.12 25.9,20.74 60.19,34.33
  pour Top (rank 3): 96,50.08 0.12,50.08 -0.01,6.9 0.5,5.88 9.89,5.88 13.07,5.5 13.07,0.17 96,-0.09
  pour Bottom: 96,50.08 0.12,50.08 0.12,-0.09 96,-0.09
N$1  (via drill 0.6)  (2 unrouted)
  Top 0.61: 90.41,11.22 88.76,12.87 v83.3,12.87 83.68,12.87
  Top 0.813: 90.16,6.26 90.16,10.58 D2.1 90.41,11.22 | JP2.1 92.27,5.76 D12.1
  Top 1.016: 31.23,32.74 30.1,32.92 30.07,32.92 2.9
  Bottom 0.61: 39.36,27.6 41.77,26.46 42.79,23.28 49.65,23.28 52.31,25.01 58.53,25.01 59.42,24.04 59.8,23.03 60.69,20.11 63.49,20.11 64.25,20.87 70.98,20.87 72,20.49 75.43,20.49 76.19,21.12 81.27,21.12 83.55,18.84 83.55,13.12 v83.3,12.87 | 39.36,29.88 38.47,30.65 36.82,32.3 JP4.2
  Bottom 0.813: 39.36,27.6 39.36,29.88 | 2.9 30.54,34.14 36.76,34.14 36.76,32.62 JP4.2
N$2  (via drill 0.6)
  Top 0.406: v15.04,39.41 11.54,39.41 10.28,38.77 IC3.10 | U$3.1 85.53,36.17 85.59,35.6 | 85.59,35.6 R31.1 | 85.59,35.6 85.2,35.47 83.68,35.47 83.3,34.71 78.56,34.71 X1.4
  Bottom 0.406: 59.74,44.82 53.71,44.82 50.41,44.87 29.71,44.87 28.69,43.35 27.29,43.35 24.37,41.76
  Bottom 0.61: X1.4 78.15,34.97 75.2,34.97 62.12,44.82 59.74,44.82 | 24.37,41.76 19.74,38.97 17.51,38.97 v15.04,39.41 14.97,39.35 11.42,39.35 9.77,40.24 9.77,45.51 11.23,46.71 14.4,46.71 15.04,47.35 X3.2
N$3  (via drill 0.6)
  Top 0.406: IC3.13 11.23,42.59 11.86,42.27 v12.18,42.27 | 83.12,38.65 U$3.4 83.05,38.65 83.05,39.41 82.92,39.54 | 80.72,39.62 82.83,39.62 82.92,39.54 | R30.1 88.38,38.9 87.24,40.05 83.43,40.05 82.92,39.54
  Top 0.61: X1.3 80.72,39.62
  Bottom 0.406: 60.76,46.52 58.98,48.55 52.76,48.55 47.3,46.4 21.39,46.4 20.24,45.38 17.51,43.09 16.37,43.09 15.13,42.21 | v12.18,42.27 12.5,41.95 14.09,41.95 15.13,42.21 | 17.26,46.4 15.67,44.81 15.67,42.75 15.13,42.21
  Bottom 0.61: X1.3 77.98,39.09 72.44,39.09 62.98,46.52 60.76,46.52 | X3.3 17.58,46.71 17.26,46.4
N$4  (1 unrouted)
  Top 0.406: 2.7 31.23,27.98 34.53,27.98 35.51,26.75
  Top 0.61: TP22.TP 29.2,26.71 2.7 | 35.51,26.75 LED6.A
  Bottom 0.406: 58.73,21 54.09,21
  Bottom 0.61: X1.8 75.4,19.06 73.14,16.55 68.28,11.69 63.45,11.69 58.73,21 | 54.09,21 40.12,21 35.8,26.46 35.67,26.58 35.48,26.65
N$5
  Top 0.305: 24.12,4.23 16.78,4.23
  Top 0.406: Q8.3 24.12,4.23 | 16.78,4.23 16.24,5.37 16.24,7.91 15.99,8.17
  Top 0.61: 15.99,8.17 R21.2
N$6  (via drill 0.6)
  Top 0.406: 38.47,25.31 D8.2 39.28,23.48 40.12,22.39 40.12,17.06 v41.01,14.52 42.53,12.74 IC7.2 | Q10.1 70.6,17.18 68.76,17.18 | 68.76,17.18 68.31,17.18 68.06,17.06 66.92,17.06 66.54,17.31 65.65,17.95 | v51.8,10.45 52.06,10.45 54.47,12.99 58.41,12.99 59.93,11.47 62.47,11.47 v64,13.5 | R22.2 68.5,20.36 68.76,19.98 68.76,17.18
  Top 0.813: 65.65,17.95 U$2.1
  Bottom 0.406: v41.01,14.52 44.95,14.52 51.17,10.45 v51.8,10.45 | v64,13.5 64,16.04 U$2.1
N$7
  Top 0.406: IC10.2 67.17,5.5 68.19,4.49 R2.2
N$8
  Top 1.27: R27.2 R28.1
N$9  (via drill 0.6)
  Top 0.406: v14.21,4.87 13.2,4.36 Q7.3 | 11.29,13.88 v11.42,13.63 | 12.43,12.99 R20.2
  Top 0.61: v11.42,13.63 12.43,12.99
  Bottom 0.406: v11.42,13.63 11.42,13.76 14.97,11.98 16.5,10.2 16.5,7.66 14.21,5.63 v14.21,4.87
N$11  (via drill 0.6)
  Top 0.406: Q1.2 87.49,20.11
  Top 0.61: START.TP v85.2,21.76
  Top 0.813: v85.2,21.76 87.49,20.11 | D15.2 86.22,32.3 84.44,32.42 82.09,32.42 78.47,30.84 X1.5
  Bottom 0.813: X1.5 79.2,30.94 81.9,28.36 81.9,24.8 83.55,23.03 85.08,21.88 v85.2,21.76
N$12  (1 unrouted)
  Top 0.61: TP16.TP 2.2 | 77.71,3.21 85.73,3.21 D13.2
  Bottom 0.711: 58.66,5.2 54.47,5.2
  Bottom 0.813: X1.12 78.21,3.21 74.66,3.21 73.78,2.83 60.06,2.83 58.66,5.2 | 54.47,5.2 54.09,5.2 53.2,3.98 41.01,3.98 35.55,7.66 33.64,7.66 LED1.K 2.2
N$13  (1 unrouted)
  Top 0.61: TP17.TP 2.3 | X1.11 82,7.18 83.43,6.39 D12.2
  Bottom 0.406: 33.05,13.93 33.52,14.11 37.07,14.11 38.34,15.79
  Bottom 0.61: 33.05,12.74 33.05,13.93 | 38.34,15.79 45.52,15.79 51.68,11.72 52.82,11.72 53.2,11.22 53.2,10.45 54.1,9.17 54.27,9.17
  Bottom 0.711: 54.27,9.17 59.03,9.17
  Bottom 0.813: 2.3 33.05,12.74 | 59.03,9.17 59.44,9.17 61.46,8.55 72,8.55 73.39,7.15 74.56,7.15 X1.11
N$14  (1 unrouted)
  Top 0.61: TP18.TP 23.72,16.23 2.4 | X1.10 77.72,11.14 77.71,11.15 79.44,11.15 79.83,11.22 D2.2
  Bottom 0.406: 37.96,16.8 36.56,14.92 33.39,14.92 33.07,16.23
  Bottom 0.61: 52.19,13.11 46.47,16.8 37.96,16.8
  Bottom 0.711: 59.49,13.11 52.19,13.11
  Bottom 0.813: X1.10 78.2,11.15 73.84,11.15 71.49,9.69 61.9,9.69 59.49,13.11 | 33.07,16.23 25.82,16.25 2.4
N$15
  Top 0.406: Q2.2 43.3,42.71 43.3,42.46
  Top 0.813: IC4.3 43.3,42.46
N$16
  Top 0.406: 45.48,7.66 45.48,6.39 IC7.8 | 45.48,7.66 IC7.6 | 45.48,7.66 45.48,8.7 46.98,10.2 46.98,14.77 47.99,16.17 48.25,16.17 48.5,16.42 49.77,17.95 49.77,20.11 49.39,20.49 48.63,20.49 47.49,21.25 47.49,25.19 48.5,26.2 R5.1
N$17  (via drill 0.6)
  Top 0.406: IC3.12 11.23,41.31 11.86,41 13.45,41 16.31,42.59 v16.94,44.17 | R29.1 85.33,42.2 84.82,42.71 81.27,42.71 | U$3.3 86.22,38.33 v86.86,38.9
  Top 0.61: 81.27,42.71 78.47,42.71 X1.2
  Bottom 0.406: 61.46,48.3 60.57,49.29 51.61,49.29 46.6,47.22 20.43,47.22 v16.94,44.17 | v86.86,38.9 84.57,38.9 80.76,42.71 78.47,42.71 X1.2
  Bottom 0.61: X1.2 78.13,42.9 76.06,43.16 73.27,46.52 69.08,46.52 64.12,48.3 61.46,48.3 | X3.4 20.43,48.94 20.43,47.22
N$18
  Top 0.406: IC3.15 7.1,45.12 6.21,44.11 6.21,36.62 5.45,35.73 5.45,24.8 4.31,23.28 IC6.5
N$19
  Top 0.406: 26.61,30.69 26.7,29.88 32.82,29.88 32.82,30.06 LED7.K | 33.01,33.84 34.2,34.73 D14.2
  Top 0.61: LED7.K 33.01,33.84
  Top 1.016: 2.8 TP23.TP 26.61,30.69
  Bottom 0.61: 33.13,43.73 30.91,39.03 29.64,39.03 28.88,38.27 28.5,37.76 25.71,34.9 25.71,31.54 | 24.73,30.52 2.8
  Bottom 0.813: X1.14 52.42,42.82 50.28,43.73 33.13,43.73 | 25.71,31.54 24.73,30.52
N$20  (via drill 0.81)  (1 unrouted)
  Top 0.813: 31.61,35.73 32.5,36.87 36.06,36.87 v36.95,37.51 38.72,38.88
  Top 1.016: 1.9 20.81,33.75 TP9.TP 25.06,34.19 26.79,35.6 30.72,35.6 31.61,35.73
  Bottom 0.813: X1.17 53.37,30.94 52.69,30.65 51.04,29.76 50.03,29.25 42.66,29.25 41.14,30.9 41.14,35.35 v36.95,37.51
N$21  (via drill 0.6)
  Top 0.61: 31.04,43.09 32.31,44.87 37.88,44.87 38.72,44.49 | 38.72,44.49 38.72,41.44 40.82,40.05 40.82,31.16 39.67,30.08 v37.39,29.57 | D11.1 38.72,44.49
  Top 1.016: 31.04,43.09 28.05,43.09 26.09,41 TP11.TP 21.07,40.68 19.2,40.68 1.11
  Bottom 0.61: X1.19 53.02,23.02 50.53,22.14 41.07,22.14 37.39,26.46 v37.39,29.57
N$22
  Top 0.406: IC8.11 63.11,43.35 62.6,43.85 61.08,43.85 | 61.08,43.85 60.57,43.35 IC8.9 | 61.08,43.85 61.08,44.11 60.44,44.8 54.09,44.8 53.07,45.3 51.8,47.28 49.14,48.68 35.93,48.68 35.18,48.19 34.41,47.54 R35.2
N$23  (via drill 0.6)
  Top 0.406: X1.22 54.34,11.14 52.13,8.73 52.13,7.33 54.09,5.2 59.42,5.2 60.89,3.91 | 60.89,3.91 R1.2 | v59.8,6.64 59.42,5.24 60.89,3.91
  Bottom 0.406: D5.C 62.34,6.01 62.34,6.14 61.84,6.64 v59.8,6.64
N$24  (1 unrouted)
  Top 0.406: 69.71,1.56 64.76,1.56 63.74,3.09 R1.1 | IC10.3 68.44,5.76 69.84,4.36 69.84,3.09 | 69.84,3.09 69.84,1.56 | C8.1 69.84,3.09
N$25
  Top 0.406: IC6.13 10.4,24.55
  Top 0.61: TP6.TP 12.97,23.22 1.6 11.42,23.28 10.78,23.92 10.4,24.55
N$26
  Top 0.406: 1.7 15.73,25.23 11.16,25.19 10.53,25.82 IC6.14
  Top 0.61: TP7.TP 18.53,26.84 1.7
N$27  (via drill 0.6)  (1 unrouted)
  Top 0.406: TP26.TP 21.07,31.66 22.59,32.17 | R3.1 v52.19,16.3 53.33,16.3 54.09,17.06 57.9,17.06 59.42,18.58 59.42,20.61 60.31,21.76 R23.1
  Top 0.61: 22.66,32.17 v24.12,32.42
  Bottom 0.406: 22.98,33.44 23.86,34.33 26.53,37.12 27.04,38.39 | 33.07,18.14 33.9,17.59 36.56,17.59 36.95,17.69 | v52.19,16.3 51.42,16.55 51.43,16.56
  Bottom 0.508: 22.98,33.44 22.21,32.3 | 27.29,18.14 33.07,18.14 | 36.95,17.69 46.72,17.69 51.43,16.56
  Bottom 0.61: 27.29,18.14 25.26,19.28 22.09,21.12 21.2,22.01 21.2,24.17 23.74,25.82 23.74,27.34 21.7,28.36 21.07,29.38 21.07,31.16 22.21,32.3 v24.12,32.42 | 2.11 29.23,40.59 27.04,38.39
N$28  (via drill 0.6)
  Top 0.406: v35.55,22.52 34.66,22.14 25.9,22.14 24.78,23.25 2.6 | v52.57,19.34 54.34,21.12 58.41,21.12 59.17,21.88 59.17,24.93 62.73,24.93 63.23,25 65.84,25 66.35,24.55 66.35,20.36 | U$2.2 67.42,18.84
  Top 0.61: TP21.TP 23.7,23.22 2.6 | 67.42,18.84 66.35,20.36
  Bottom 0.406: v52.57,19.34 51.04,19.34 50.79,19.6 39.36,19.6 v35.55,22.52
N$29
  Top 0.61: JP3.1 R23.2
N$30
  Top 0.406: R25.2 C5.1 50.28,3.21 | IC7.9 50.41,7.53 50.91,6.9 50.91,4.74 50.28,4.1 50.28,3.21 | 50.28,3.21 R8.2
N$31
  Top 0.406: IC7.14 49.65,14.08 49.65,15.28 51.17,17.31 51.17,21.38 50.53,22.14 | R9.2 50.53,22.14 | 50.53,22.14 C9.2
N$32  (via drill 0.6)
  Top 0.305: 67.04,31.28 66.54,30.77 63.81,30.77 63.49,31.16
  Top 0.406: IC5.2 64.76,36.23 67.04,33.95 67.04,31.28 67.93,31.28 68.69,30.84 70.43,30.84 72.02,28.66 72.78,28.11 D3.2 74.03,27.94 C1.2 R24.1 74.16,35.09 75.68,36.56 80.51,36.56 80.69,36.43 81.27,36.11 v81.65,35.85 81.9,35.98 82.48,36.43 U$3.6 | 63.49,31.16 IC5.6
N$34
  Top 0.61: LED6.K 31.38,25.35 R4.1
N$35
  Top 0.406: R5.2 48.5,32.21 IC4.1
  Top 0.61: R18.1 48.4,34.86 IC4.1
  Bottom 0.711: 53.84,32.91 59.36,32.91
  Bottom 0.762: 63.36,27.14 69.84,27.14
  Bottom 0.813: 53.84,32.91 51.42,31.79 IC4.1 | 62.62,30.88 63.36,27.14
  Bottom 1.016: 59.36,32.91 62.62,30.88 | X1.7 78.12,22.92 75.52,22.92 74.66,24.17 72.89,24.93 69.84,27.14
N$36
  Top 0.406: R9.1 51.04,25.69 51.04,37.63 49.75,40.2 47.18,40.2 46.98,40.4 Q2.1
N$37  (via drill 0.6)
  Top 0.406: IC3.2 4.24,45.12 v5.58,47.03 | IC6.7 4.81,20.74 v5.07,21
  Bottom 0.406: 5.07,46.52 4.56,46.01 4.56,35.09 4.81,34.84 4.81,32.68 1.26,31.92 1.26,21 v5.07,21
  Bottom 0.61: v5.58,47.03 5.07,46.52
N$38
  Top 0.406: 1.3 17.89,13.26 17.89,16.42 16.37,17.95 13.83,17.95 10.15,22.01 IC6.11
  Top 0.61: TP3.TP 18.21,12.52 1.3
N$39
  Top 0.406: 1.5 15.85,19.75 14.73,20.87 12.43,20.87 11.16,22.14 10.53,22.9 10.15,23.28 IC6.12
  Top 0.61: 1.5 18.44,21.4 TP5.TP
N$41
  Top 0.61: LED1.A 35.55,8.93 36.06,8.42 37.64,8.42 R11.1 | LED2.A LED3.A LED4.A
  Bottom 0.508: 31.61,25.57 31.61,27.6
  Bottom 0.61: LED1.A LED2.A | 31.61,25.57 31.61,25.19 33.77,21.5 LED4.A | 31.61,27.6 32.5,28.74 34.04,28.74 LED7.A
N$42
  Top 0.406: X1.16 58.47,34.9 58.53,34.84 61.08,30.65 61.08,30.01 R33.2
N$43
  Top 0.406: R13.2 89.65,17.31 89.65,17.32 Q1.1
N$44  (via drill 0.6)
  Top 0.406: IC6.2 IC6.1 2.4,29.02 2.4,31.28 | 2.4,31.28 2.4,33.7 5.32,36.74 5.32,42.97 4.43,43.85 IC3.3 | Q11.1 9.01,34.2 v7.99,33.7 | v3.29,31.28 2.4,31.28
  Bottom 0.406: v7.99,33.7 7.99,32.93 5.2,31.28 v3.29,31.28
N$45
  Top 0.406: C2.1 43.62,20.08 R10.1 R12.2
N$46
  Top 0.406: IC7.4 45.71,10.2 46.22,10.96 46.22,15.28 47.74,17.31 48.37,18.07 R12.1 48.12,19.75 C3.1
N$47
  Top 0.406: R17.2 R16.2 38.6,12.87 39.1,12.36 39.1,10.71 R15.1 41.01,8.93 IC7.5
N$48
  Top 0.406: R7.2 74.79,20.61 74.79,18.2 Q10.3
N$49
  Top 0.406: R17.1 38.22,17.82 38.22,20.03 D8.1
N$50  (via drill 0.6)
  Top 0.406: IC6.4 4.12,24.55 4.56,25.19 4.56,31.09 v3.67,33.44
  Top 0.61: v3.29,48.3 3.29,46.4 IC3.1
  Bottom 0.406: v3.67,33.44 3.74,33.44 3.68,33.49
  Bottom 0.61: 3.68,33.49 3.67,33.63 3.67,47.79 v3.29,48.3
N$52
  Top 0.406: 12.89,30.2 1.8 12.31,30.88 Q11.3 | 15.67,30.08 TP8.TP
  Top 0.61: TP8.TP 12.99,30.2 | 12.81,30.2 12.99,30.2 | 12.99,30.2 1.8
N$53  (via drill 0.6)
  Top 0.61: TP25.TP 23.8,37.19
  Top 0.813: v30.59,37.19 23.8,37.19 2.10
  Bottom 0.813: X1.15 36.56,41.76 34.28,41.76 32.5,37.89 31.1,37.19 v30.59,37.19
N$54
  Top 0.813: D1.1 92.19,14.52 92.32,14.39
  Top 1.27: 92.32,14.39 92.95,13.63 R27.1
N$55
  Top 0.61: TP19.TP 31.86,18.86 30.98,19.75 2.5 | X1.9 80.2,14.77 85.02,14.77 D1.2
  Bottom 0.406: LED4.K 34.22,18.43 36.44,18.43 36.82,18.71 | 53.93,17.03 57.17,17.03 58.92,17.06
  Bottom 0.61: 2.5 LED4.K | 36.82,18.71 47.08,18.71 50.28,17.95 52.06,17.95 53.74,17.03 53.93,17.03 | X1.9 78.08,15.03 73.9,15.03 69.33,10.71 62.73,10.71 58.92,17.06
N$56  (1 unrouted)
  Top 0.406: IC3.14 7.74,43.85 7.1,43.22 7.1,36.36 6.34,35.35 6.34,24.3 4.43,22.01 2.65,22.01
N$57  (via drill 0.6)  (1 unrouted)
  Top 0.406: Q8.1 24.12,0.55 13.91,0.55 Q7.1 | 8.62,8.93 X2.2
  Top 0.61: X2.2 5.83,8.93 | 5.83,8.93 v5.51,8.99 | 5.83,8.93 3.99,8.93 R38.1 | 9.89,7.41 8.62,8.93 | Q7.1 12.33,2.58 Q7.2 | 9.89,2.83 5.32,2.83 | 9.13,1.06 9.13,3.09 | 8.37,2.58 8.37,4.61
  Top 0.813: 9.89,2.83 9.89,7.41
  Bottom 0.61: X2.2 v5.51,8.99 3.92,9.25 | 3.54,9.37 R39.1
  pour Top: 13.2,5.12 2.02,5.12 2.02,0.04 13.2,0.04
N$59
  Top 0.406: Q8.2 16.5,2.58 14.97,6.14 12.43,6.14 TP2.TP
  Top 0.61: TP2.TP 12.3,8.42 12.3,9.05 1.2 | 21.07,1.69 19.67,1.69 | 21.07,3.47 19.67,3.47
  pour Top: 23.86,3.85 17.01,3.85 15.74,5.12 15.48,10.45 10.66,10.45 10.4,9.44 10.66,7.41 13.2,5.37 13.2,5.12 13.83,4.61 13.83,0.8 23.86,0.8
N$61  (1 unrouted)
  Top 0.305: 2.78,25.82 1.13,25.82 1.13,29.25 1.51,29.76
  Top 0.406: 1.51,29.76 1.51,34.08 4.48,37.06 4.48,40.05 IC3.6
N$63
  Top 1.422: 60.57,26.33 60.57,27.47
N$64
  Top 0.61: IC4.2 R18.2
N$65
  Top 0.406: R26.2 60.57,35.98 61.33,35.09 62.22,34.02 IC5.5
N$67
  Top 0.406: IC6.10 10.15,20.74 12.05,18.45 12.05,17.14 1.4
  Top 0.61: TP4.TP 12.96,16.23 1.4
N$69
  Top 0.61: TP1.TP 1.1
  Bottom 0.61: 36.25,1.63 30.09,1.63
  Bottom 1.016: X1.1 80.51,46.71 82.41,45.12 82.41,44.55 90.41,39.03 90.41,6.01 83.94,6.01 82.92,4.99 82.92,2.01 82.03,0.62 52.38,0.62 49.26,1.18 39.87,1.18 36.25,1.63 | 30.09,1.63 28.25,3.28 22.57,3.28 1.1
N$83
  Top 0.406: 44.95,3.34 44.95,4.74 IC7.7 | 46.03,3.53 R25.1 46.22,3.34 44.95,3.34 | 44.95,3.34 43.93,3.34 R6.1
N$84  (via drill 0.8)  (1 unrouted)
  Top 0.406: 51.68,13.12 R3.2 52.69,13.38 54.34,15.03 56.29,15.03 X1.21 56.44,14.64 61.46,14.64
  Top 0.61: 61.46,14.64 Q9.2
  Top 0.813: IC6.16 8.88,28.36 v8.88,30.01
N$85
  Top 0.406: Q9.1 64.24,16.06 65.15,15.28 R32.2
N$86
  Top 0.406: R26.1 60.95,39.41 63.49,39.41 | 63.49,39.41 IC5.3 | IC8.12 64.38,40.3 63.49,39.41
N$87
  Top 0.406: R33.1 63.11,27.66 68.44,27.66 69.33,27.34 D3.1
N$88  (via drill 0.6)
  Top 0.406: IC6.15 9.03,26.96 v11.93,26.96 | R13.1 v81.27,17.31
  Bottom 0.406: v11.93,26.96 14.47,25.19 15.48,25.19 16.24,24.42 16.24,21.63 15.48,20.87 15.48,19.34 19.29,15.53 19.29,15.03 20.82,13.5 20.82,12.11 19.04,10.33 19.04,8.42 23.1,4.36 29.2,4.36 31.23,2.45 35.43,2.45 36.07,2.96 51.82,2.96 53.47,1.69 53.45,1.69 53.84,1.64 81.01,1.64 81.78,2.58 81.78,16.3 v81.27,17.31
N$89
  Top 0.406: IC8.14 66.92,40.3 69.58,38.65 69.58,37.25 R34.1 | 70.47,35.85 R34.1 | C10.1 68.69,33.82 70.47,35.22 R34.1
N$90  (via drill 0.5)
  Top 0.254: R35.1 27.67,45.51 v27.8,45.38 27.93,45.51 28.69,47.54
  Top 0.406: TP13.TP 23.73,44.24 2.12 23.99,44.51 23.99,45.63 25.9,47.54 R35.1
N$92
  Top 0.406: IC10.1 65.9,8.55 66.54,9.18 R42.2
N$93  (via drill 0.6)
  Top 0.813: D11.2 35.25,41.06 D10.2 34.28,38.9 v35.42,40.43
  Top 1.016: 1.10 TP10.TP 18.02,36.62 19.54,38.13 22.4,39.09 26.15,39.09 26.47,38.77 32.25,38.77 32.75,41.06
  Top 1.93: 32.75,41.06 35.25,41.06
  Bottom 0.61: 63.73,32.81 63.73,32.54 | SJ1.1 65.01,32.81 64.24,32.03
  Bottom 0.711: 54.22,36.87 59.55,36.87
  Bottom 0.813: v35.42,40.43 36.82,40.43 54.22,36.87 | 59.55,36.87 63.36,32.91 63.73,32.54 64.24,32.03 65.01,31.26 JP1.1
N$94
  Bottom 0.61: 69.49,32.42 68.6,32.81 SJ1.2
  Bottom 0.813: 87.36,27.6 R36.2 | 87.36,27.6 R37.2 | JP1.2 67.55,30.52 69.49,32.42 69.97,32.93 81.39,32.93 86.6,27.6 87.36,27.6
N$95
  Top 0.813: JP2.2 93.21,3.21 92.32,3.09 D13.1
N$96
  Top 0.406: C11.1 R42.1 R43.1
N$97
  Top 0.406: IC10.5 69.9,12.29 70.73,13.12 | 70.73,13.12 71.36,13.76 71.36,15.66 R44.2 | R43.2 71.87,11.98 70.73,13.12
N$98
  Top 0.406: 38.22,34.82 38.68,34.82 D14.1
  Top 0.61: JP4.1 39.36,34.41 D14.1
N$99
  Top 0.406: 71.62,20.61 71.23,19.73 | R7.1 71.62,20.61 | 71.62,20.61 71.62,23.28 72,23.79 R14.1
  Top 0.813: 71.23,19.73 U$2.3
N$101
  Top 0.406: R45.1 61.58,8.8 63.23,7.15 63.23,6.52 R46.2 63.36,7.15 64.76,8.17 64.76,9.44 65.52,10.2 67.81,10.2 68.31,10.71 68.31,12.16 IC10.6
N$580  (1 unrouted)
  Top 0.406: IC7.1 43.68,15.15 43.3,16.23 R19.2 43.3,17.57 42.53,17.95 42.28,18.07 R10.2
VCC  (via drill 0.6)
  Top 0.406: R19.1 45.26,16.23 45.43,15.15 45.43,11.47 IC7.3 41.64,11.47 41.14,11.98 41.07,11.98 R15.2 | R6.2 42.41,2.33 42.41,4.99 41.27,6.13 41.27,6.26 | IC2.1 36.47,5.73 35.93,6.14 | R45.2 63.36,10.58 | 63.36,10.58 65.01,12.23 65.84,12.23 IC10.8 | 63.36,10.58 60.57,10.58 59.17,9.18 53.84,9.18 v53.07,7.91 | 6V.TP 32.63,7.28 33.71,6.2
  Top 0.61: v40.12,13.12 R15.2 | 35.93,6.9 37.83,6.9 | 37.83,6.9 39.36,6.9 | C4.1 33.71,6.2 33.77,6.14 | R11.2 37.83,6.9
  Top 0.813: 35.93,6.9 35.93,6.14 IC1.OUT 33.77,6.14 | 39.36,6.9 40.63,6.9 | 40.63,6.9 v40.5,7.03 | 41.27,6.26 40.63,6.9
  Bottom 0.406: v53.07,7.91 50.91,7.91 49.26,6.64 48.88,6.26 42.15,6.26 41.39,7.03 v40.5,7.03
  Bottom 0.61: v40.5,7.03 40.5,12.61 v40.12,13.12

### Text on the board
Bottom: top | BEP V3.1 / maru-labs.com
tPlace: 4 | 2 | 3 | 1 | b | c | 5 | a | 5 | 4 | 3 | 1 | 2
bPlace: QC
tNames: 78L10 | N | BSS138 | N | BSS138 | 78L06 | GND / / <> / / N / / G4 / / G2 / / CC | < / / > / / G5 / / G3 / / G1 / / / BAT
bNames: GND c b a 12V | GND / BT / HiB | BL <> / Resistor | RPM | RPM / SPD / HiB | WRN | 18 | solder / bridge to / enable / Bulb Test / on WRN | 2.7 / 2.6 | 19 | 1.12 GND / 1.11< / 1.10<> / 1.9 > / 1 8 N / 1.7 G5 / 1.6 4 / 1.5 G3 / 1.4 G2 / 1.3 G1 | 1.2 CC | solder / bridge to / enable / Choke / on WRN | 1 BAT / 2 GC / 3 GB / 4 GA / / / 7 RES / 8 ABS / 9 ALT / 10 TMP / OIL | ALT / TMP / OIL / CHK / SWP | 1.1 BAT | 2.12 / 2.11 / 2.10 / / / / / 2.5 / 2.4 / 2.3 / 2.2 / 2.1 | CHK | 13 / 14 / 15 / 16 / 17 / / / / 21 SPDin / 22 SPDout / 23 / 24
tValues: M7 | M7 | SS12 | M7 | M7 | M7 | BA | 2.4/1.1V | 6,8 | M7 | 4 | SS12 | 13 GND / 14 BT / 15 HiB / 16RPM / 17 > / 18 GND / 19 < / / 21SPD in / 22SPD out / 23 GND | RPM / / HiB / / BT / / BAR / / TMP / / CHK | SPD / / WRN / / ABS / / ALT / / OIL / / SWP | 6V | SS12 | BA | 1 BAT / 2 GC / 3 GB / 4 GA / 5 START / 6SWP / 7RES / 8 ABS / 9ALT / 10 TMP / 11 OIL / 12 CHK | SS12 | BA | 4.7V
bValues: 2.2 kOhm / SPD / Pull-up / (Middle / Switch ) | OFF ON | BT | > | ABS | OFF/ ON | BAR/RES | > | BAR/RES | Mode / Selector
bStop: BEP V3.0 / maru-labs.com